# Altium project DashLogger.PrjPcb
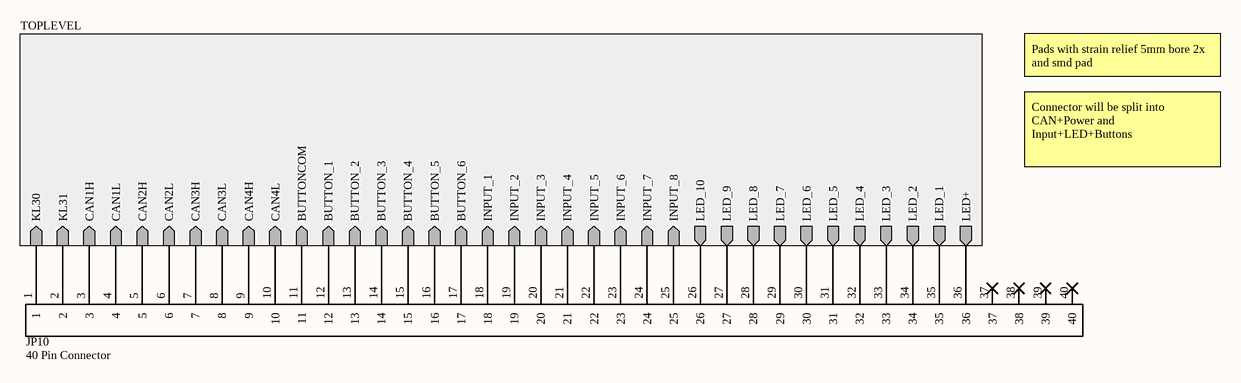
[diagram p0: DashLogger.SchDoc]
9 sheets, 166 parts. Net scope: strictly hierarchical (ports join the sheet entries above them; power ports are local).
Board file: PCB1.PcbDoc
Sheets:
  DashLogger.SchDoc
    TOPLEVEL = TopLevel.SchDoc
      DISPLAY = Display.SchDoc
      MICROCONTROLLER = Microcontroller.SchDoc
      INPUTS = Inputs.SchDoc
      LEDS = LEDs.SchDoc
      POWER = Power.SchDoc
      CAN1 = CANInterface.SchDoc
      CAN2 = CANInterface.SchDoc
      CAN3 = CANInterface.SchDoc
      CAN4 = CANInterface.SchDoc
      STORAGE = Storage.SchDoc

## Sheet DashLogger.SchDoc
size A4; SheetNumber: 1; SheetTotal: 9

### Parts
JP10  40 Pin Connector

### Sub-sheets
TOPLEVEL = TopLevel.SchDoc: KL30 (in), KL31 (in), CAN1H (in), CAN1L (in), CAN2H (in), CAN2L (in), CAN3H (in), CAN3L (in), CAN4H (in), CAN4L (in), BUTTONCOM (in), BUTTON_1 (in), BUTTON_2 (in), BUTTON_3 (in), BUTTON_4 (in), BUTTON_5 (in), BUTTON_6 (in), INPUT_1 (in), INPUT_2 (in), INPUT_3 (in), INPUT_4 (in), INPUT_5 (in), INPUT_6 (in), INPUT_7 (in), INPUT_8 (in), LED_10 (out), LED_9 (out), LED_8 (out), LED_7 (out), LED_6 (out), LED_5 (out), LED_4 (out), LED_3 (out), LED_2 (out), LED_1 (out), LED+ (out)

### Nets
GND: JP10.2 ; sheet TOPLEVEL/KL31
VBAT: JP10.36 ; sheet TOPLEVEL/LED+
Net9R1_2: JP10.3 ; sheet TOPLEVEL/CAN1H
Net9R2_1: JP10.4 ; sheet TOPLEVEL/CAN1L
Net10R1_2: JP10.5 ; sheet TOPLEVEL/CAN2H
Net10R2_1: JP10.6 ; sheet TOPLEVEL/CAN2L
Net11R1_2: JP10.7 ; sheet TOPLEVEL/CAN3H
Net11R2_1: JP10.8 ; sheet TOPLEVEL/CAN3L
Net12R1_2: JP10.9 ; sheet TOPLEVEL/CAN4H
Net12R2_1: JP10.10 ; sheet TOPLEVEL/CAN4L
NetC102_2: JP10.12 ; sheet TOPLEVEL/BUTTON_1
NetC103_2: JP10.13 ; sheet TOPLEVEL/BUTTON_2
NetC104_2: JP10.14 ; sheet TOPLEVEL/BUTTON_3
NetC105_2: JP10.15 ; sheet TOPLEVEL/BUTTON_4
NetC106_2: JP10.16 ; sheet TOPLEVEL/BUTTON_5
NetC107_2: JP10.17 ; sheet TOPLEVEL/BUTTON_6
NetC109_2: JP10.1 ; sheet TOPLEVEL/KL30
NetD4_3: JP10.11 ; sheet TOPLEVEL/BUTTONCOM
NetJP10_18: JP10.18 ; sheet TOPLEVEL/INPUT_1
NetJP10_19: JP10.19 ; sheet TOPLEVEL/INPUT_2
NetJP10_20: JP10.20 ; sheet TOPLEVEL/INPUT_3
NetJP10_21: JP10.21 ; sheet TOPLEVEL/INPUT_4
NetJP10_22: JP10.22 ; sheet TOPLEVEL/INPUT_5
NetJP10_23: JP10.23 ; sheet TOPLEVEL/INPUT_6
NetJP10_24: JP10.24 ; sheet TOPLEVEL/INPUT_7
NetJP10_25: JP10.25 ; sheet TOPLEVEL/INPUT_8
NetJP10_26: JP10.26 ; sheet TOPLEVEL/LED_10
NetJP10_27: JP10.27 ; sheet TOPLEVEL/LED_9
NetJP10_28: JP10.28 ; sheet TOPLEVEL/LED_8
NetJP10_29: JP10.29 ; sheet TOPLEVEL/LED_7
NetJP10_30: JP10.30 ; sheet TOPLEVEL/LED_6
NetJP10_31: JP10.31 ; sheet TOPLEVEL/LED_5
NetJP10_32: JP10.32 ; sheet TOPLEVEL/LED_4
NetJP10_33: JP10.33 ; sheet TOPLEVEL/LED_3
NetJP10_34: JP10.34 ; sheet TOPLEVEL/LED_2
NetJP10_35: JP10.35 ; sheet TOPLEVEL/LED_1

Not connected (* = marked no-connect by the designer): JP10 37* 38* 39* 40*

### Notes on the sheet
- Pads with strain relief 5mm bore 2x and smd pad
- Connector will be split into CAN+Power and Input+LED+Buttons

### Library data of the parts
JP10 = MainConnector

## Sheet TopLevel.SchDoc
size A4; SheetNumber: 2; SheetTotal: 9
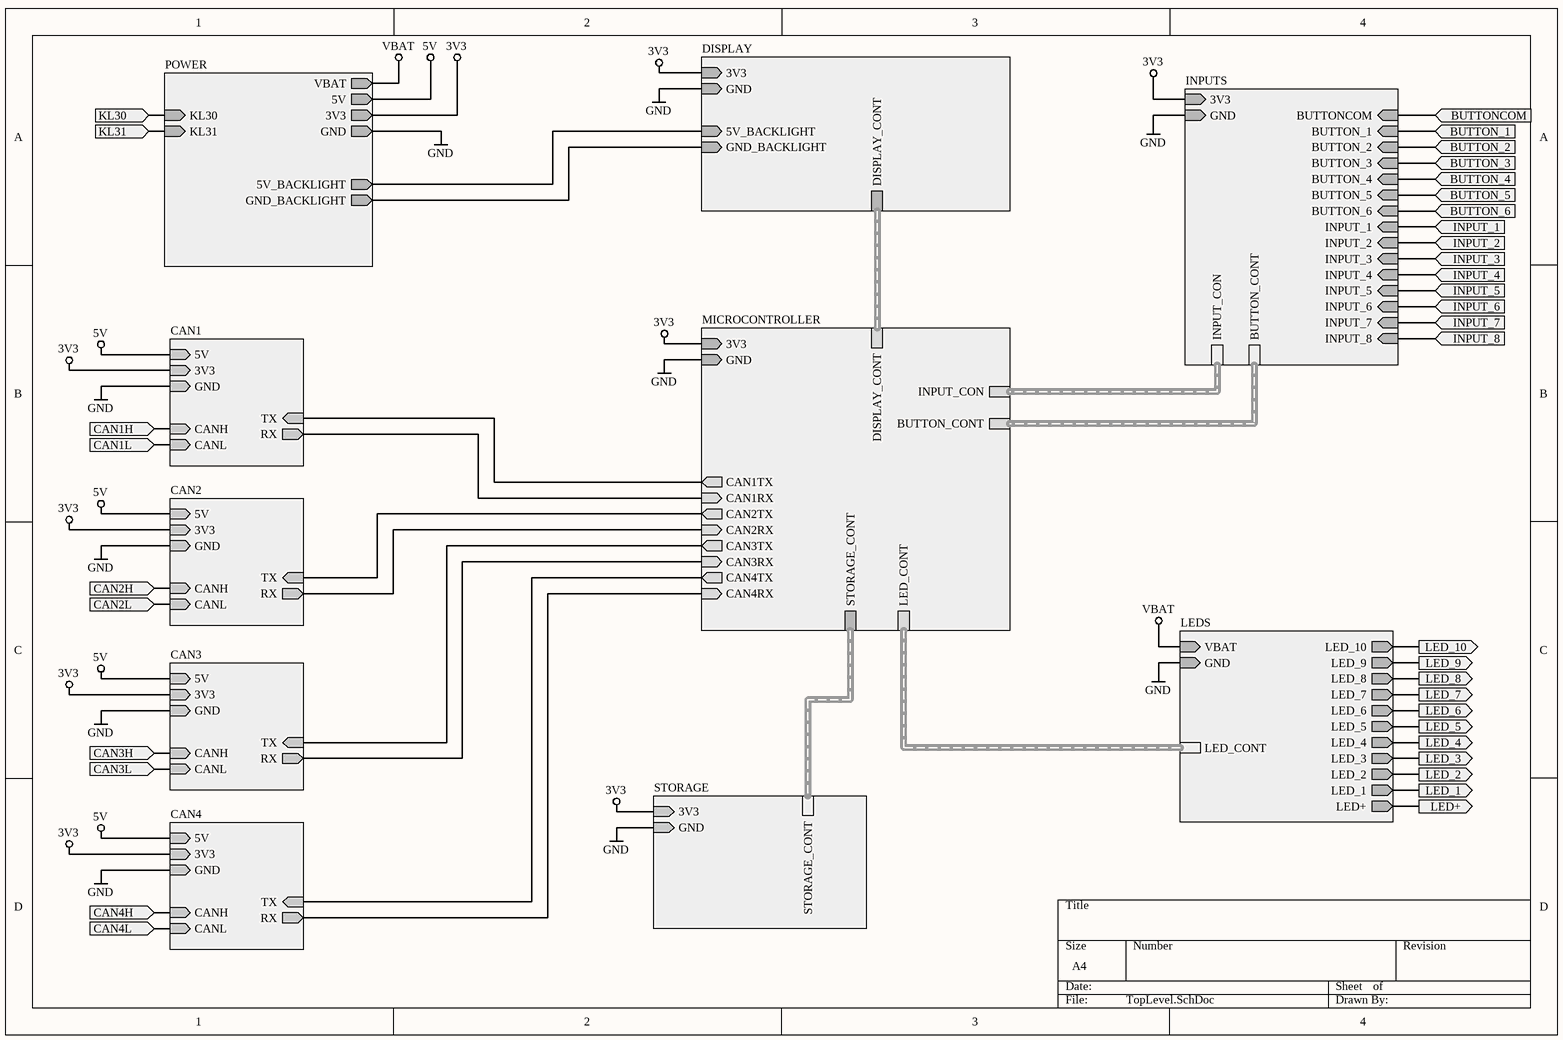
[diagram p1: TopLevel.SchDoc]

### Sub-sheets
CAN1 = CANInterface.SchDoc: 5V (in), GND (in), CANL (in), CANH (in), 3V3 (in), TX (in), RX (out)  | SchematicSymbolName: CAN1
CAN2 = CANInterface.SchDoc: 5V (in), GND (in), CANL (in), CANH (in), 3V3 (in), TX (in), RX (out)  | SchematicSymbolName: CAN2
CAN3 = CANInterface.SchDoc: 5V (in), GND (in), CANL (in), CANH (in), 3V3 (in), TX (in), RX (out)  | SchematicSymbolName: CAN3
CAN4 = CANInterface.SchDoc: 5V (in), GND (in), CANL (in), CANH (in), 3V3 (in), TX (in), RX (out)  | SchematicSymbolName: CAN4
DISPLAY = Display.SchDoc: 5V_BACKLIGHT (in), GND_BACKLIGHT (in), DISPLAY_CONT (harness DISPLAY_CONT), 3V3 (in), GND (in)
INPUTS = Inputs.SchDoc: 3V3 (in), GND (in), BUTTONCOM (in), BUTTON_1 (in), BUTTON_2 (in), BUTTON_3 (in), BUTTON_4 (in), BUTTON_5 (in), BUTTON_6 (in), INPUT_1 (in), INPUT_2 (in), INPUT_3 (in), INPUT_4 (in), INPUT_5 (in), INPUT_6 (in), INPUT_7 (in), INPUT_8 (in), INPUT_CON (harness INPUT_CON), BUTTON_CONT (harness BUTTON_CONT)
LEDS = LEDs.SchDoc: LED_10 (out), LED_9 (out), LED_8 (out), LED_7 (out), LED_6 (out), LED_5 (out), LED_4 (out), LED_3 (out), LED_2 (out), LED_1 (out), LED_CONT (harness LED_CONT), GND (in), VBAT (in), LED+ (out)
MICROCONTROLLER = Microcontroller.SchDoc: STORAGE_CONT (harness STORAGE_CONT), GND (in), 3V3 (in), INPUT_CON (harness INPUT_CON), BUTTON_CONT (harness BUTTON_CONT), LED_CONT (harness LED_CONT), CAN2RX (in), CAN3TX (out), CAN2TX (out), CAN3RX (in), CAN4TX (out), CAN4RX (in), CAN1TX (out), CAN1RX (in), DISPLAY_CONT (harness DISPLAY_CONT)
POWER = Power.SchDoc: KL30 (in), KL31 (in), 5V (out), 5V_BACKLIGHT (out), 3V3 (out), GND (out), GND_BACKLIGHT (out), VBAT (out)
STORAGE = Storage.SchDoc: 3V3 (in), GND (in), STORAGE_CONT (harness STORAGE_CONT)

### Ports
BUTTON_1 (in), BUTTON_2 (in), BUTTON_3 (in), BUTTON_4 (in), BUTTON_5 (in), BUTTON_6 (in), BUTTONCOM (in), CAN1H (in), CAN1L (in), CAN2H (in), CAN2L (in), CAN3H (in), CAN3L (in), CAN4H (in), CAN4L (in), INPUT_1 (in), INPUT_2 (in), INPUT_3 (in), INPUT_4 (in), INPUT_5 (in), INPUT_6 (in), INPUT_7 (in), INPUT_8 (in), KL30 (in), KL31 (in), LED+ (out), LED_1 (out), LED_2 (out), LED_3 (out), LED_4 (out), LED_5 (out), LED_6 (out), LED_7 (out), LED_8 (out), LED_9 (out), LED_10 (out)

### Nets
3V3: sheet DISPLAY/3V3, sheet MICROCONTROLLER/3V3, sheet INPUTS/3V3, sheet POWER/3V3, sheet CAN1/3V3, sheet CAN2/3V3, sheet CAN3/3V3, sheet CAN4/3V3, sheet STORAGE/3V3
5V: sheet POWER/5V, sheet CAN1/5V, sheet CAN2/5V, sheet CAN3/5V, sheet CAN4/5V
GND: port KL31, sheet DISPLAY/GND, sheet MICROCONTROLLER/GND, sheet INPUTS/GND, sheet LEDS/GND, sheet POWER/KL31, sheet POWER/GND, sheet CAN1/GND, sheet CAN2/GND, sheet CAN3/GND, sheet CAN4/GND, sheet STORAGE/GND
VBAT: port LED+, sheet LEDS/VBAT, sheet LEDS/LED+, sheet POWER/VBAT
Net9R1_2: port CAN1H, sheet CAN1/CANH
Net9R2_1: port CAN1L, sheet CAN1/CANL
Net10R1_2: port CAN2H, sheet CAN2/CANH
Net10R2_1: port CAN2L, sheet CAN2/CANL
Net11R1_2: port CAN3H, sheet CAN3/CANH
Net11R2_1: port CAN3L, sheet CAN3/CANL
Net12R1_2: port CAN4H, sheet CAN4/CANH
Net12R2_1: port CAN4L, sheet CAN4/CANL
NetC102_2: port BUTTON_1, sheet INPUTS/BUTTON_1
NetC103_2: port BUTTON_2, sheet INPUTS/BUTTON_2
NetC104_2: port BUTTON_3, sheet INPUTS/BUTTON_3
NetC105_2: port BUTTON_4, sheet INPUTS/BUTTON_4
NetC106_2: port BUTTON_5, sheet INPUTS/BUTTON_5
NetC107_2: port BUTTON_6, sheet INPUTS/BUTTON_6
NetC109_2: port KL30, sheet POWER/KL30
NetD4_3: port BUTTONCOM, sheet INPUTS/BUTTONCOM
NetIC?#1_1: sheet MICROCONTROLLER/CAN1TX, sheet CAN1/TX
NetIC?#1_4: sheet MICROCONTROLLER/CAN1RX, sheet CAN1/RX
NetIC?#2_1: sheet MICROCONTROLLER/CAN2TX, sheet CAN2/TX
NetIC?#2_4: sheet MICROCONTROLLER/CAN2RX, sheet CAN2/RX
NetIC?#3_1: sheet MICROCONTROLLER/CAN3TX, sheet CAN3/TX
NetIC?#3_4: sheet MICROCONTROLLER/CAN3RX, sheet CAN3/RX
NetIC?#4_1: sheet MICROCONTROLLER/CAN4TX, sheet CAN4/TX
NetIC?#4_4: sheet MICROCONTROLLER/CAN4RX, sheet CAN4/RX
NetJP10_18: port INPUT_1, sheet INPUTS/INPUT_1
NetJP10_19: port INPUT_2, sheet INPUTS/INPUT_2
NetJP10_20: port INPUT_3, sheet INPUTS/INPUT_3
NetJP10_21: port INPUT_4, sheet INPUTS/INPUT_4
NetJP10_22: port INPUT_5, sheet INPUTS/INPUT_5
NetJP10_23: port INPUT_6, sheet INPUTS/INPUT_6
NetJP10_24: port INPUT_7, sheet INPUTS/INPUT_7
NetJP10_25: port INPUT_8, sheet INPUTS/INPUT_8
NetJP10_26: port LED_10, sheet LEDS/LED_10
NetJP10_27: port LED_9, sheet LEDS/LED_9
NetJP10_28: port LED_8, sheet LEDS/LED_8
NetJP10_29: port LED_7, sheet LEDS/LED_7
NetJP10_30: port LED_6, sheet LEDS/LED_6
NetJP10_31: port LED_5, sheet LEDS/LED_5
NetJP10_32: port LED_4, sheet LEDS/LED_4
NetJP10_33: port LED_3, sheet LEDS/LED_3
NetJP10_34: port LED_2, sheet LEDS/LED_2
NetJP10_35: port LED_1, sheet LEDS/LED_1
NetJP?#1_17: sheet DISPLAY/5V_BACKLIGHT, sheet POWER/5V_BACKLIGHT
NetJP?#1_19: sheet DISPLAY/GND_BACKLIGHT, sheet POWER/GND_BACKLIGHT

### Buses and harness runs
harness sheet DISPLAY/DISPLAY_CONT = sheet MICROCONTROLLER/DISPLAY_CONT
harness sheet INPUTS/BUTTON_CONT = sheet MICROCONTROLLER/BUTTON_CONT
harness sheet INPUTS/INPUT_CON = sheet MICROCONTROLLER/INPUT_CON
harness sheet LEDS/LED_CONT = sheet MICROCONTROLLER/LED_CONT
harness sheet MICROCONTROLLER/STORAGE_CONT = sheet STORAGE/STORAGE_CONT

## Sheet Display.SchDoc
size A4; SheetNumber: 6; SheetTotal: 9
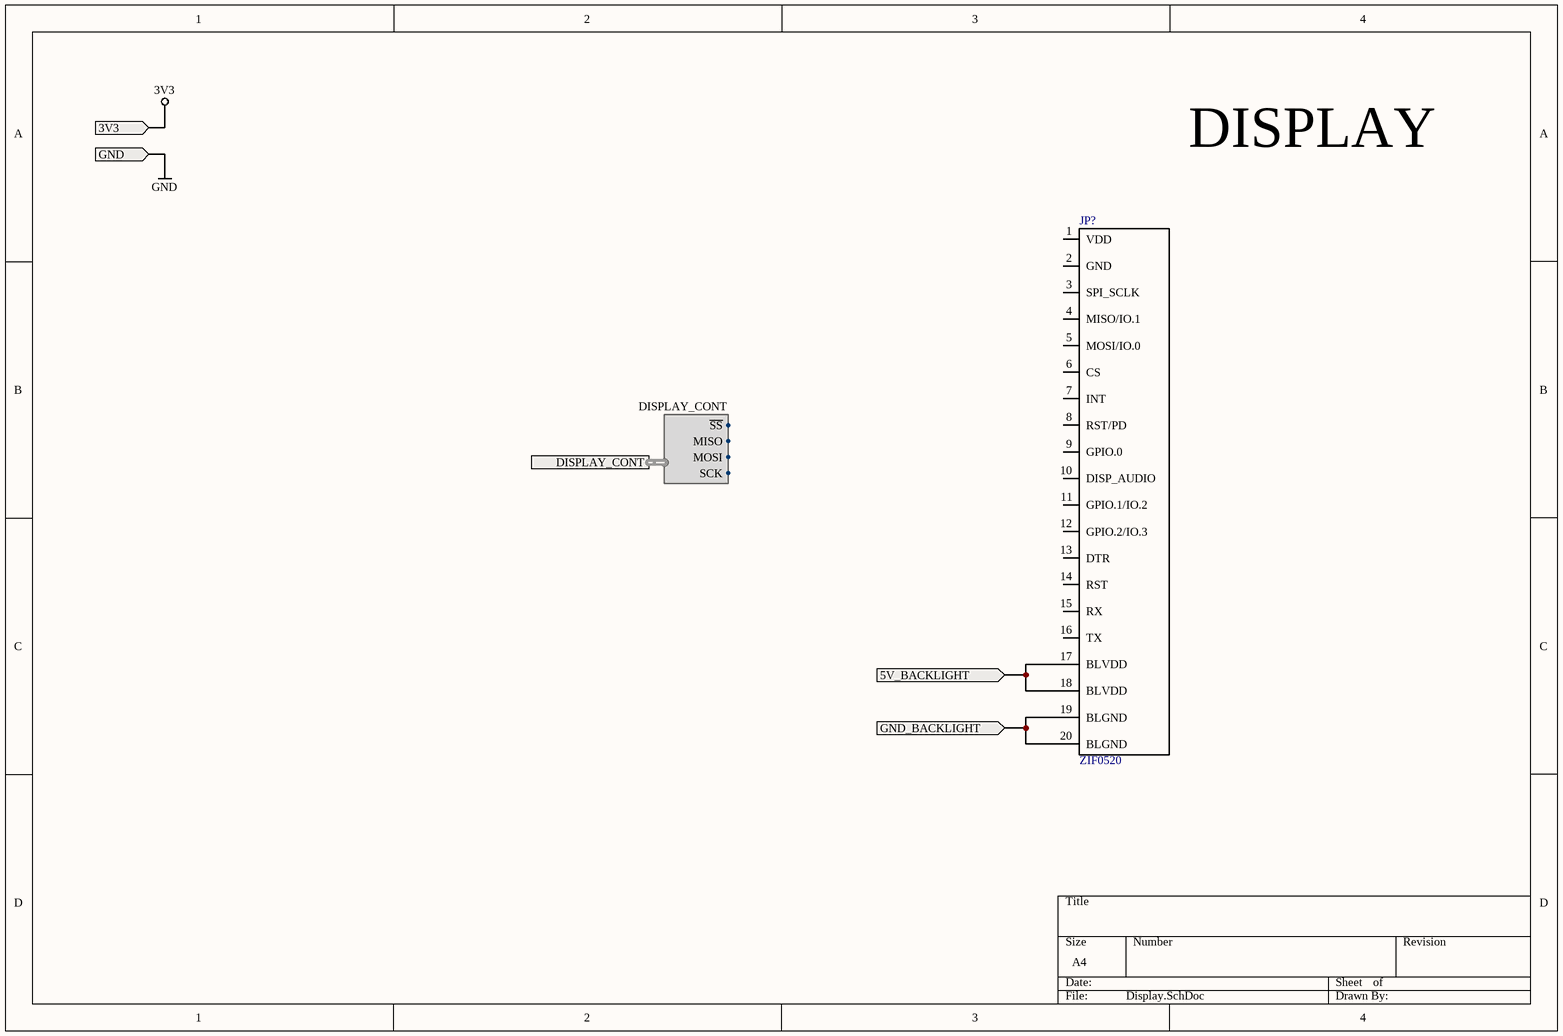
[diagram p2: Display.SchDoc]

### Parts
(Parts that share a designator on the sheet are numbered #1, #2 ... from top to bottom, then left to right.)
JP?#1  ZIF0520

### Ports
3V3 (in), 5V_BACKLIGHT (in), DISPLAY_CONT (harness DISPLAY_CONT), GND (in), GND_BACKLIGHT (in)

### Harnesses
DISPLAY_CONT: MOSI, MISO, SCK, ~{SS}

### Nets
NetJP?#1_17: JP?#1.17(BLVDD) JP?#1.18(BLVDD) ; port 5V_BACKLIGHT
NetJP?#1_19: JP?#1.19(BLGND) JP?#1.20(BLGND) ; port GND_BACKLIGHT

Not connected (* = marked no-connect by the designer): JP?#1 1(VDD) 2(GND) 3(SPI_SCLK) 4(MISO/IO.1) 5(MOSI/IO.0) 6(CS) 7(INT) 8(RST/PD) 9(GPIO.0) 10(DISP_AUDIO) 11(GPIO.1/IO.2) 12(GPIO.2/IO.3) 13(DTR) 14(RST) 15(RX) 16(TX)

### Notes on the sheet
- DISPLAY

### Library data of the parts
JP?#1 = ZIF0520: Display Connector RiBus

## Sheet Microcontroller.SchDoc
size A3; SheetNumber: 5; SheetTotal: 9
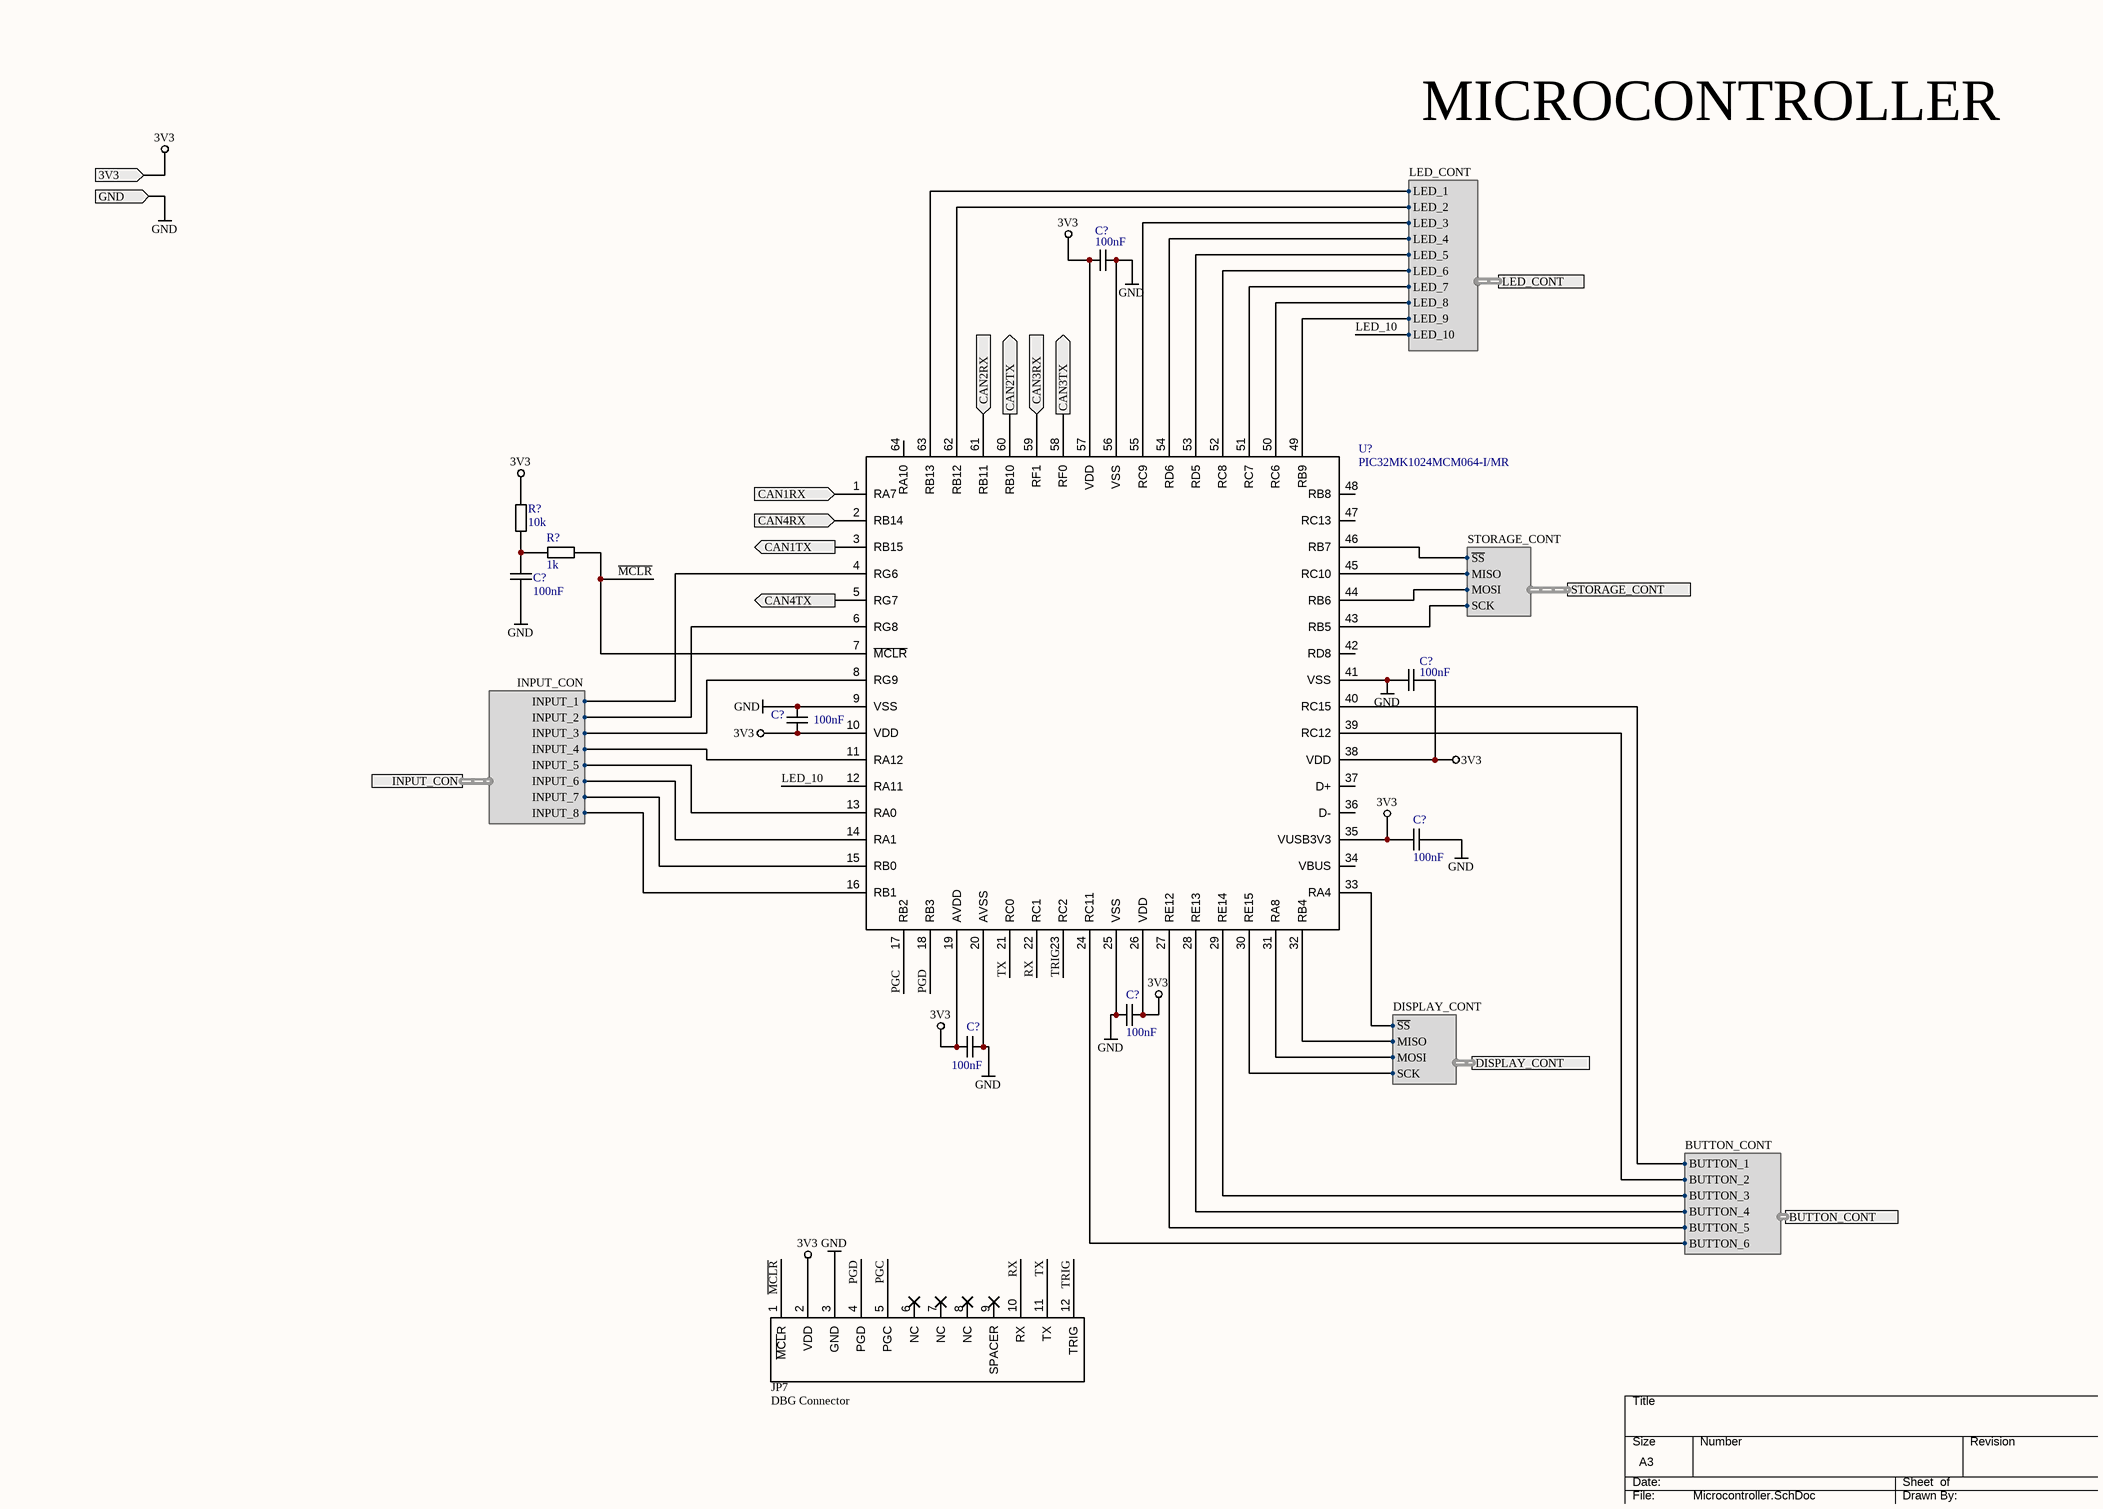
[diagram p3: Microcontroller.SchDoc]

### Parts
(Parts that share a designator on the sheet are numbered #1, #2 ... from top to bottom, then left to right.)
C?#1  100nF  [C_0402]
C?#2  100nF  [C_0402]
C?#3  100nF  [C_0402]
C?#4  100nF  [C_0402]
C?#5  100nF  [C_0402]
C?#6  100nF  [C_0402]
C?#7  100nF  [C_0402]
JP7  DBG Connector  [HDRV12W63P0X254_1X12_3048X254X950P]
R?#1  10k  [R_0402]
R?#2  1k  [R_0402]
U?  PIC32MK1024MCM064-I/MR  [PIC32MK1024MCM064-I/MR]

### Ports
3V3 (in), BUTTON_CONT (harness BUTTON_CONT), CAN1RX (in), CAN1TX (out), CAN2RX (in), CAN2TX (out), CAN3RX (in), CAN3TX (out), CAN4RX (in), CAN4TX (out), DISPLAY_CONT (harness DISPLAY_CONT), GND (in), INPUT_CON (harness INPUT_CON), LED_CONT (harness LED_CONT), STORAGE_CONT (harness STORAGE_CONT)

### Harnesses
INPUT_CON: INPUT_1, INPUT_2, INPUT_3, INPUT_4, INPUT_5, INPUT_6, INPUT_7, INPUT_8
LED_CONT: LED_1, LED_2, LED_3, LED_4, LED_5, LED_6, LED_7, LED_8, LED_9, LED_10
BUTTON_CONT: BUTTON_1, BUTTON_2, BUTTON_3, BUTTON_4, BUTTON_5, BUTTON_6
DISPLAY_CONT: MOSI, MISO, SCK, ~{SS}
STORAGE_CONT: MOSI, MISO, SCK, ~{SS}

### Nets
3V3: C?#1.1 C?#3.1 C?#4.1 C?#5.1 C?#6.1 C?#7.1 JP7.2(VDD) R?#1.2 U?.10(VDD) U?.19(AVDD) U?.26(VDD) U?.35(VUSB3V3) U?.38(VDD) U?.57(VDD) ; port 3V3
GND: C?#1.2 C?#2.1 C?#3.2 C?#4.2 C?#5.2 C?#6.2 C?#7.2 JP7.3(GND) U?.9(VSS) U?.20(AVSS) U?.25(VSS) U?.41(VSS) U?.56(VSS) ; port GND
LED_10: U?.12(RA11) ; port LED_CONT.LED_10
~{MCLR}: JP7.1(~{MCL}R) R?#2.2 U?.7(~{MCLR})  [project net ~{MCLR}_5]
PGC: JP7.5(PGC) U?.17(RB2)  [project net PGC_5]
PGD: JP7.4(PGD) U?.18(RB3)  [project net PGD_5]
RX: JP7.10(RX) U?.22(RC1)  [project net RX_5]
TRIG: JP7.12(TRIG) U?.23(RC2)  [project net TRIG_5]
TX: JP7.11(TX) U?.21(RC0)  [project net TX_5]
NetC102_2: U?.40(RC15) ; port BUTTON_CONT.BUTTON_1
NetC103_2: U?.39(RC12) ; port BUTTON_CONT.BUTTON_2
NetC104_2: U?.29(RE14) ; port BUTTON_CONT.BUTTON_3
NetC105_2: U?.28(RE13) ; port BUTTON_CONT.BUTTON_4
NetC106_2: U?.27(RE12) ; port BUTTON_CONT.BUTTON_5
NetC107_2: U?.24(RC11) ; port BUTTON_CONT.BUTTON_6
NetC?#2_2: C?#2.2 R?#1.1 R?#2.1
NetD5_3: U?.4(RG6) ; port INPUT_CON.INPUT_1
NetD6_3: U?.6(RG8) ; port INPUT_CON.INPUT_2
NetD8_3: U?.8(RG9) ; port INPUT_CON.INPUT_3
NetD10_3: U?.11(RA12) ; port INPUT_CON.INPUT_4
NetD11_3: U?.13(RA0) ; port INPUT_CON.INPUT_5
NetD13_3: U?.14(RA1) ; port INPUT_CON.INPUT_6
NetD15_3: U?.15(RB0) ; port INPUT_CON.INPUT_7
NetD17_3: U?.16(RB1) ; port INPUT_CON.INPUT_8
NetIC?#1_1: U?.3(RB15) ; port CAN1TX
NetIC?#1_4: U?.1(RA7) ; port CAN1RX
NetIC?#2_1: U?.60(RB10) ; port CAN2TX
NetIC?#2_4: U?.61(RB11) ; port CAN2RX
NetIC?#3_1: U?.58(RF0) ; port CAN3TX
NetIC?#3_4: U?.59(RF1) ; port CAN3RX
NetIC?#4_1: U?.5(RG7) ; port CAN4TX
NetIC?#4_4: U?.2(RB14) ; port CAN4RX
NetR25_1: U?.63(RB13) ; port LED_CONT.LED_1
NetR38_1: U?.62(RB12) ; port LED_CONT.LED_2
NetR41_1: U?.55(RC9) ; port LED_CONT.LED_3
NetR44_1: U?.54(RD6) ; port LED_CONT.LED_4
NetR47_1: U?.53(RD5) ; port LED_CONT.LED_5
NetR50_1: U?.52(RC8) ; port LED_CONT.LED_6
NetR53_1: U?.51(RC7) ; port LED_CONT.LED_7
NetR79_1: U?.50(RC6) ; port LED_CONT.LED_8
NetR82_1: U?.49(RB9) ; port LED_CONT.LED_9
NetU?_30: U?.30(RE15) ; port DISPLAY_CONT.SCK
NetU?_31: U?.31(RA8) ; port DISPLAY_CONT.MOSI
NetU?_32: U?.32(RB4) ; port DISPLAY_CONT.MISO
NetU?_33: U?.33(RA4) ; port DISPLAY_CONT.~{SS}
NetU?_43: U?.43(RB5) ; port STORAGE_CONT.SCK
NetU?_44: U?.44(RB6) ; port STORAGE_CONT.MOSI
NetU?_45: U?.45(RC10) ; port STORAGE_CONT.MISO
NetU?_46: U?.46(RB7) ; port STORAGE_CONT.~{SS}

Not connected (* = marked no-connect by the designer): JP7 6(NC)* 7(NC)* 8(NC)* 9(SPACER)*; U? 34(VBUS) 36(D-) 37(D+) 42(RD8) 47(RC13) 48(RB8) 64(RA10)

### Notes on the sheet
- MICROCONTROLLER
- THIS DOCUMENT AND THE DATA DISCLOSED HEREIN OR
- HEREWITH IS THE PROPERTY OF ALTIUM LIMITED AND MAY
- DWG NO:
- REVISION
- REV:
- DESCRIPTION
- DATE
- APPROVED
- BE FREELY DISTRIBUTED IN WHOLE. NO RIGHTS ARE
- RESERVED OR EXPRESS OR IMPLIED WARANTEE GIVEN.
- ENG:
- APPROVALS
- PROJECT
- DSN:
- CHK:
- REFERENCE DOCUMENTS
- PROJECT REVISION:
- TITLE
- DOCUMENT REVISION:
- DESIGN ITEM:
- BOM:
- FAB DWG:
- PCB DWG:
- ASSY DWG:
- SCALE:
- A3
- SIZE
- CAGE CODE
- FILE NAME
- DWG NO.
- SHEET
- OF
- REV

### Library data of the parts
C?#1 C?#3-C?#7 = C0402C104J8RACAUTO: 100nF 10V 0402 X7R
C?#2 = CGA2B3X7R1H104K050BE: 100nF 50V X7R
JP7 = PICKitConnector: 2.54mm Header for Pickit 4
R?#1 = SFR01MZPF1002: 10k 1% 62.5mW
R?#2 = ESR01MZPJ102: 1k 5% 200mW
U? = PIC32MK1024MCM064-I/MR: RC13 and RB8 only Inputs (when used are slower)

## Sheet Inputs.SchDoc
size A4; SheetNumber: 8; SheetTotal: 9
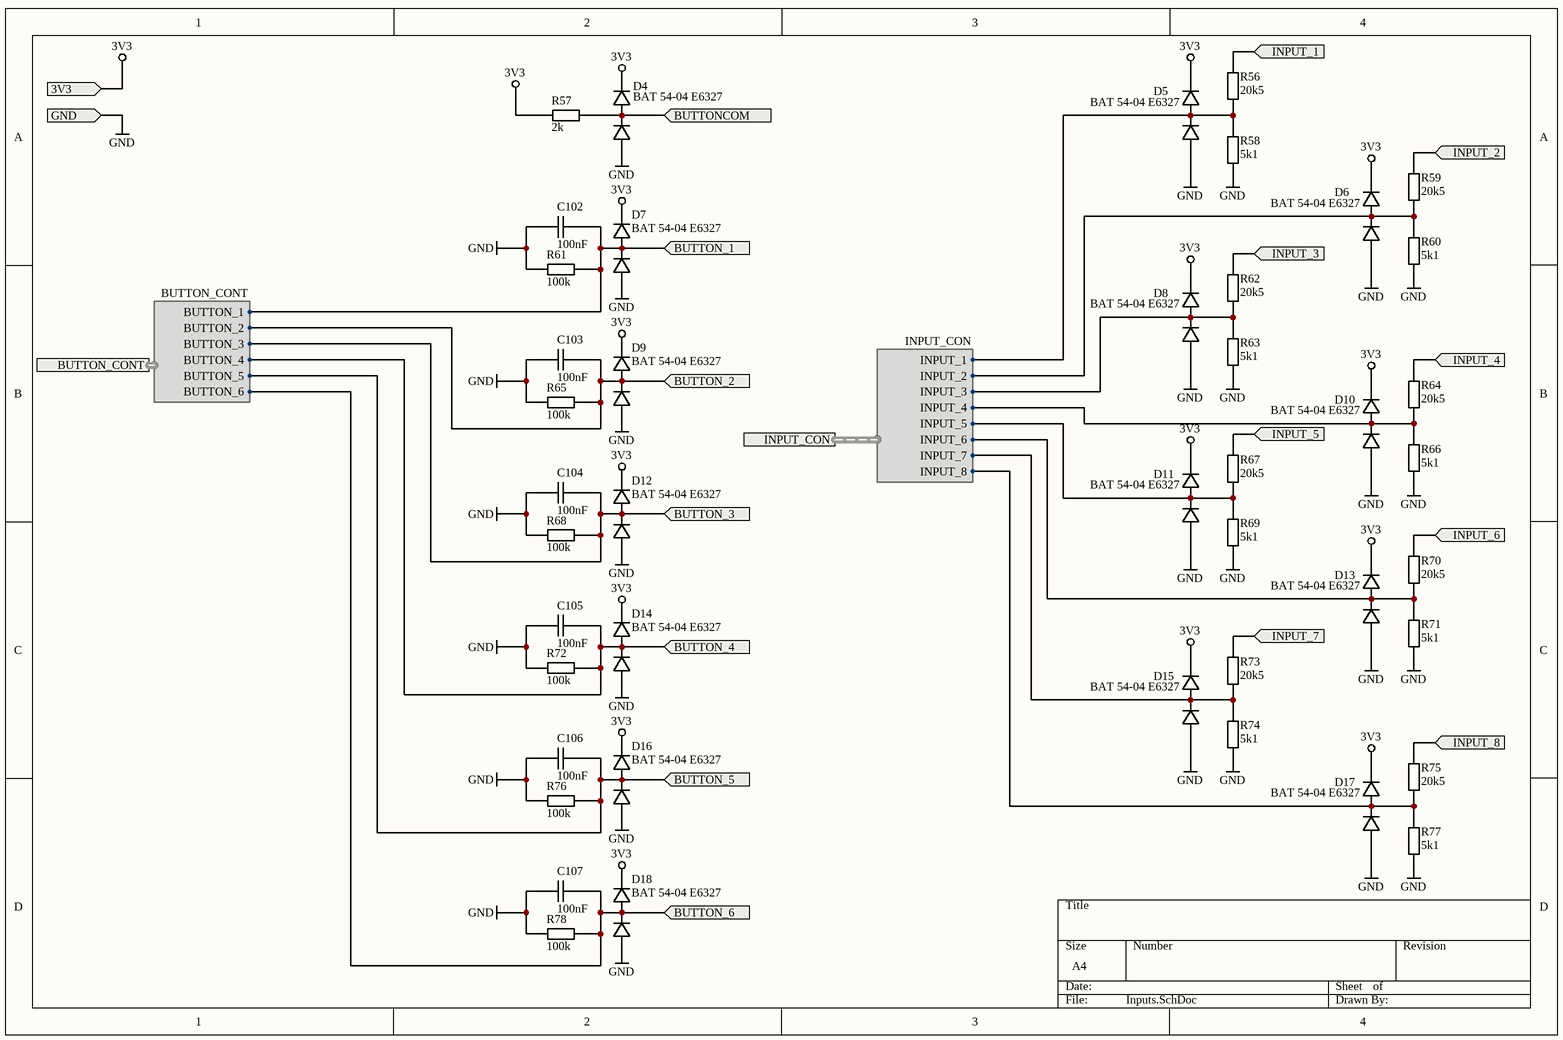
[diagram p4: Inputs.SchDoc]

### Parts
C102  100nF  [C_0402]
C103  100nF  [C_0402]
C104  100nF  [C_0402]
C105  100nF  [C_0402]
C106  100nF  [C_0402]
C107  100nF  [C_0402]
D4  BAT 54-04 E6327  [SOT95P240X110-3N]
D5  BAT 54-04 E6327  [SOT95P240X110-3N]
D6  BAT 54-04 E6327  [SOT95P240X110-3N]
D7  BAT 54-04 E6327  [SOT95P240X110-3N]
D8  BAT 54-04 E6327  [SOT95P240X110-3N]
D9  BAT 54-04 E6327  [SOT95P240X110-3N]
D10  BAT 54-04 E6327  [SOT95P240X110-3N]
D11  BAT 54-04 E6327  [SOT95P240X110-3N]
D12  BAT 54-04 E6327  [SOT95P240X110-3N]
D13  BAT 54-04 E6327  [SOT95P240X110-3N]
D14  BAT 54-04 E6327  [SOT95P240X110-3N]
D15  BAT 54-04 E6327  [SOT95P240X110-3N]
D16  BAT 54-04 E6327  [SOT95P240X110-3N]
D17  BAT 54-04 E6327  [SOT95P240X110-3N]
D18  BAT 54-04 E6327  [SOT95P240X110-3N]
R56  20k5  [R_0402]
R57  2k  [R_0402]
R58  5k1  [R_0402]
R59  20k5  [R_0402]
R60  5k1  [R_0402]
R61  100k  [R_0402]
R62  20k5  [R_0402]
R63  5k1  [R_0402]
R64  20k5  [R_0402]
R65  100k  [R_0402]
R66  5k1  [R_0402]
R67  20k5  [R_0402]
R68  100k  [R_0402]
R69  5k1  [R_0402]
R70  20k5  [R_0402]
R71  5k1  [R_0402]
R72  100k  [R_0402]
R73  20k5  [R_0402]
R74  5k1  [R_0402]
R75  20k5  [R_0402]
R76  100k  [R_0402]
R77  5k1  [R_0402]
R78  100k  [R_0402]

### Ports
3V3 (in), BUTTON_1 (in), BUTTON_2 (in), BUTTON_3 (in), BUTTON_4 (in), BUTTON_5 (in), BUTTON_6 (in), BUTTON_CONT (harness BUTTON_CONT), BUTTONCOM (in), GND (in), INPUT_1 (in), INPUT_2 (in), INPUT_3 (in), INPUT_4 (in), INPUT_5 (in), INPUT_6 (in), INPUT_7 (in), INPUT_8 (in), INPUT_CON (harness INPUT_CON)

### Harnesses
BUTTON_CONT: BUTTON_1, BUTTON_2, BUTTON_3, BUTTON_4, BUTTON_5, BUTTON_6
INPUT_CON: INPUT_1, INPUT_2, INPUT_3, INPUT_4, INPUT_5, INPUT_6, INPUT_7, INPUT_8

### Nets
3V3: D4.2 D5.2 D6.2 D7.2 D8.2 D9.2 D10.2 D11.2 D12.2 D13.2 D14.2 D15.2 D16.2 D17.2 D18.2 R57.1 ; port 3V3
GND: C102.1 C103.1 C104.1 C105.1 C106.1 C107.1 D4.1 D5.1 D6.1 D7.1 D8.1 D9.1 D10.1 D11.1 D12.1 D13.1 D14.1 D15.1 D16.1 D17.1 D18.1 R58.1 R60.1 R61.1 R63.1 R65.1 R66.1 R68.1 R69.1 R71.1 R72.1 R74.1 R76.1 R77.1 R78.1 ; port GND
NetC102_2: C102.2 D7.3 R61.2 ; port BUTTON_1, port BUTTON_CONT.BUTTON_1
NetC103_2: C103.2 D9.3 R65.2 ; port BUTTON_2, port BUTTON_CONT.BUTTON_2
NetC104_2: C104.2 D12.3 R68.2 ; port BUTTON_3, port BUTTON_CONT.BUTTON_3
NetC105_2: C105.2 D14.3 R72.2 ; port BUTTON_4, port BUTTON_CONT.BUTTON_4
NetC106_2: C106.2 D16.3 R76.2 ; port BUTTON_5, port BUTTON_CONT.BUTTON_5
NetC107_2: C107.2 D18.3 R78.2 ; port BUTTON_6, port BUTTON_CONT.BUTTON_6
NetD4_3: D4.3 R57.2 ; port BUTTONCOM
NetD5_3: D5.3 R56.1 R58.2 ; port INPUT_CON.INPUT_1
NetD6_3: D6.3 R59.1 R60.2 ; port INPUT_CON.INPUT_2
NetD8_3: D8.3 R62.1 R63.2 ; port INPUT_CON.INPUT_3
NetD10_3: D10.3 R64.1 R66.2 ; port INPUT_CON.INPUT_4
NetD11_3: D11.3 R67.1 R69.2 ; port INPUT_CON.INPUT_5
NetD13_3: D13.3 R70.1 R71.2 ; port INPUT_CON.INPUT_6
NetD15_3: D15.3 R73.1 R74.2 ; port INPUT_CON.INPUT_7
NetD17_3: D17.3 R75.1 R77.2 ; port INPUT_CON.INPUT_8
NetJP10_18: R56.2 ; port INPUT_1
NetJP10_19: R59.2 ; port INPUT_2
NetJP10_20: R62.2 ; port INPUT_3
NetJP10_21: R64.2 ; port INPUT_4
NetJP10_22: R67.2 ; port INPUT_5
NetJP10_23: R70.2 ; port INPUT_6
NetJP10_24: R73.2 ; port INPUT_7
NetJP10_25: R75.2 ; port INPUT_8

### Library data of the parts
C102-C107 = C0402C104J8RACAUTO: 100nF 10V 0402 X7R
D4-D18 = BAT 54-04 E6327: Clamping Diode
R56 R59 R62 R64 R67 R70 R73 R75 = ERJ2RKF2052X: 20k5 1% 100mW
R57 = AC0402FR-072KL: 2k 1% 62.5mW
R58 R60 R63 R66 R69 R71 R74 R77 = MP000528: 5k1 1% 100mW
R61 R65 R68 R72 R76 R78 = CRCW0402100KJNED: 100k 5% 62.5mW

## Sheet LEDs.SchDoc
size A4; SheetNumber: 8; SheetTotal: 9
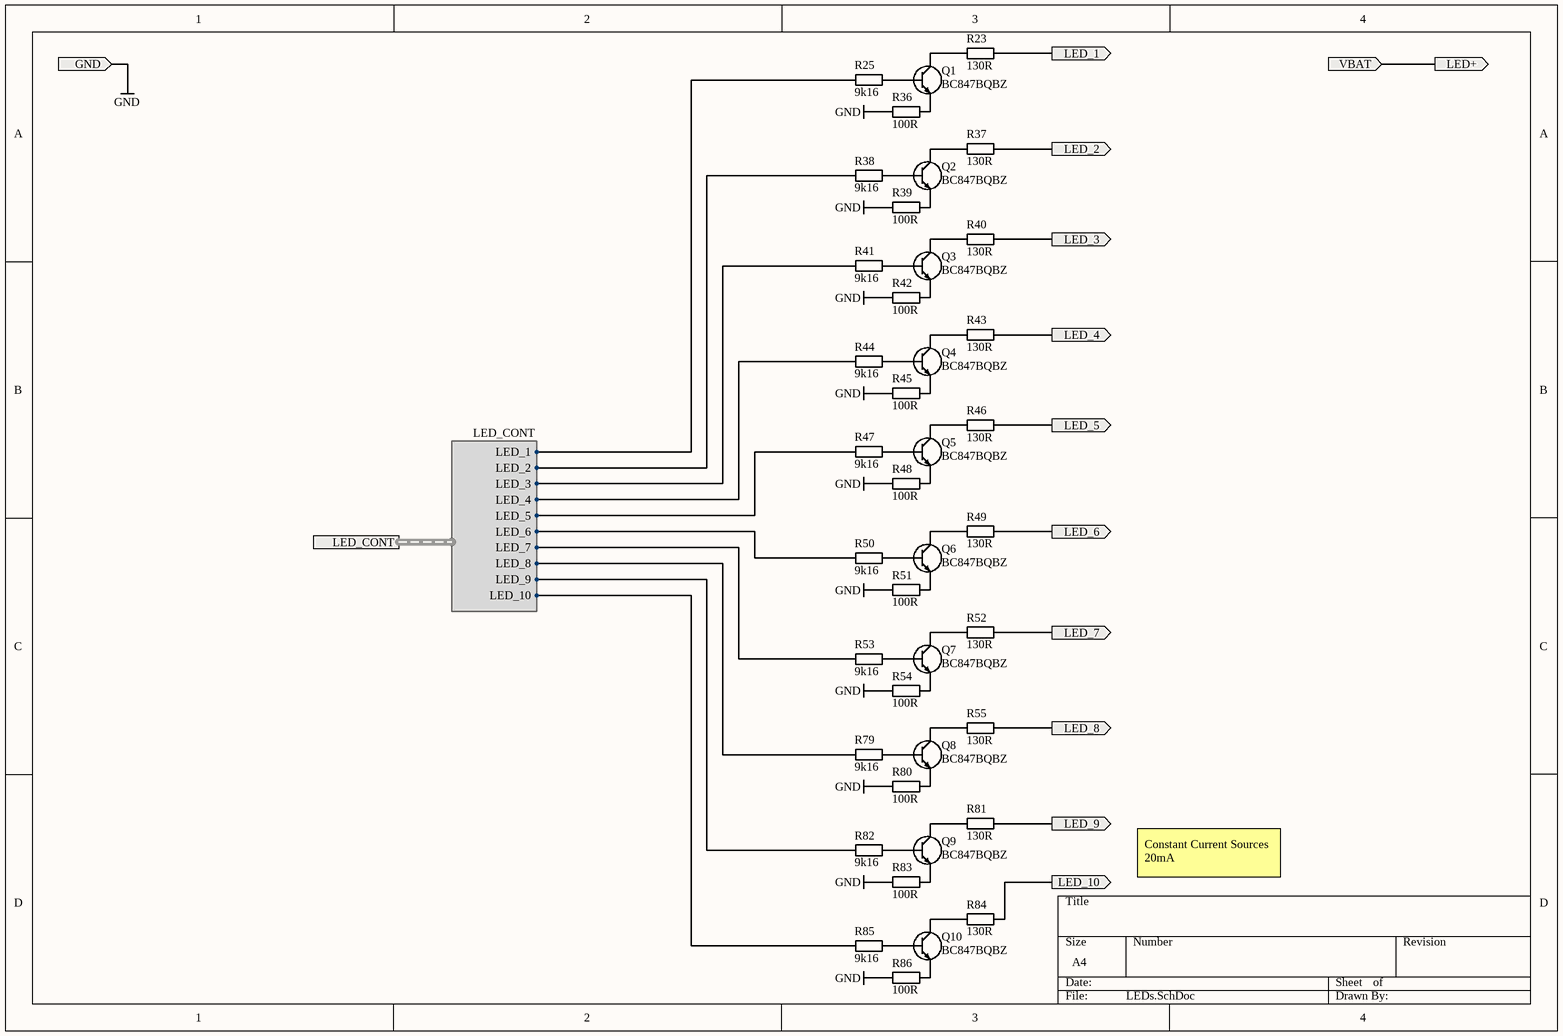
[diagram p5: LEDs.SchDoc]

### Parts
Q1  BC847BQBZ  [PESD2CANFD24UQBZ]
Q2  BC847BQBZ  [PESD2CANFD24UQBZ]
Q3  BC847BQBZ  [PESD2CANFD24UQBZ]
Q4  BC847BQBZ  [PESD2CANFD24UQBZ]
Q5  BC847BQBZ  [PESD2CANFD24UQBZ]
Q6  BC847BQBZ  [PESD2CANFD24UQBZ]
Q7  BC847BQBZ  [PESD2CANFD24UQBZ]
Q8  BC847BQBZ  [PESD2CANFD24UQBZ]
Q9  BC847BQBZ  [PESD2CANFD24UQBZ]
Q10  BC847BQBZ  [PESD2CANFD24UQBZ]
R23  130R  [R_1210]
R25  9k16  [R_0402]
R36  100R  [R_1210]
R37  130R  [R_1210]
R38  9k16  [R_0402]
R39  100R  [R_1210]
R40  130R  [R_1210]
R41  9k16  [R_0402]
R42  100R  [R_1210]
R43  130R  [R_1210]
R44  9k16  [R_0402]
R45  100R  [R_1210]
R46  130R  [R_1210]
R47  9k16  [R_0402]
R48  100R  [R_1210]
R49  130R  [R_1210]
R50  9k16  [R_0402]
R51  100R  [R_1210]
R52  130R  [R_1210]
R53  9k16  [R_0402]
R54  100R  [R_1210]
R55  130R  [R_1210]
R79  9k16  [R_0402]
R80  100R  [R_1210]
R81  130R  [R_1210]
R82  9k16  [R_0402]
R83  100R  [R_1210]
R84  130R  [R_1210]
R85  9k16  [R_0402]
R86  100R  [R_1210]

### Ports
GND (in), LED+ (out), LED_1 (out), LED_2 (out), LED_3 (out), LED_4 (out), LED_5 (out), LED_6 (out), LED_7 (out), LED_8 (out), LED_9 (out), LED_10 (out), LED_CONT (harness LED_CONT), VBAT (in)

### Harnesses
LED_CONT: LED_1, LED_2, LED_3, LED_4, LED_5, LED_6, LED_7, LED_8, LED_9, LED_10

### Nets
GND: R36.2 R39.2 R42.2 R45.2 R48.2 R51.2 R54.2 R80.2 R83.2 R86.2 ; port GND
VBAT: port VBAT, port LED+
LED_10: R85.1 ; port LED_CONT.LED_10
NetJP10_26: R84.2 ; port LED_10
NetJP10_27: R81.2 ; port LED_9
NetJP10_28: R55.2 ; port LED_8
NetJP10_29: R52.2 ; port LED_7
NetJP10_30: R49.2 ; port LED_6
NetJP10_31: R46.2 ; port LED_5
NetJP10_32: R43.2 ; port LED_4
NetJP10_33: R40.2 ; port LED_3
NetJP10_34: R37.2 ; port LED_2
NetJP10_35: R23.2 ; port LED_1
NetQ1_1: Q1.1(B) R25.2
NetQ1_2: Q1.2(E) R36.1
NetQ1_3: Q1.3(C) R23.1
NetQ2_1: Q2.1(B) R38.2
NetQ2_2: Q2.2(E) R39.1
NetQ2_3: Q2.3(C) R37.1
NetQ3_1: Q3.1(B) R41.2
NetQ3_2: Q3.2(E) R42.1
NetQ3_3: Q3.3(C) R40.1
NetQ4_1: Q4.1(B) R44.2
NetQ4_2: Q4.2(E) R45.1
NetQ4_3: Q4.3(C) R43.1
NetQ5_1: Q5.1(B) R47.2
NetQ5_2: Q5.2(E) R48.1
NetQ5_3: Q5.3(C) R46.1
NetQ6_1: Q6.1(B) R50.2
NetQ6_2: Q6.2(E) R51.1
NetQ6_3: Q6.3(C) R49.1
NetQ7_1: Q7.1(B) R53.2
NetQ7_2: Q7.2(E) R54.1
NetQ7_3: Q7.3(C) R52.1
NetQ8_1: Q8.1(B) R79.2
NetQ8_2: Q8.2(E) R80.1
NetQ8_3: Q8.3(C) R55.1
NetQ9_1: Q9.1(B) R82.2
NetQ9_2: Q9.2(E) R83.1
NetQ9_3: Q9.3(C) R81.1
NetQ10_1: Q10.1(B) R85.2
NetQ10_2: Q10.2(E) R86.1
NetQ10_3: Q10.3(C) R84.1
NetR25_1: R25.1 ; port LED_CONT.LED_1
NetR38_1: R38.1 ; port LED_CONT.LED_2
NetR41_1: R41.1 ; port LED_CONT.LED_3
NetR44_1: R44.1 ; port LED_CONT.LED_4
NetR47_1: R47.1 ; port LED_CONT.LED_5
NetR50_1: R50.1 ; port LED_CONT.LED_6
NetR53_1: R53.1 ; port LED_CONT.LED_7
NetR79_1: R79.1 ; port LED_CONT.LED_8
NetR82_1: R82.1 ; port LED_CONT.LED_9

### Notes on the sheet
- Constant Current Sources 20mA

### Library data of the parts
Q1-Q10 = BC847BQBZ: NPN Transistor 45V 100mA 100MHz; Manufacturer_Name: Nexperia; Manufacturer_Part_Number: BC847CQBZ; Datasheet Link: https://assets.nexperia.com/documents/data-sheet/BC847XQB_SER.pdf; Height: 0.5mm; Mouser Part Number: 771-BC847CQBZ; Mouser Price/Stock: https://www.mouser.co.uk/ProductDetail/Nexperia/BC847CQBZ?qs=GBLSl2AkirulMH7yF0zTsA%3D%3D
R23 R37 R40 R43 R46 R49 R52 R55 R81 R84 = ERJP14F1300U: 130R 1% 500mW
R25 R38 R41 R44 R47 R50 R53 R79 R82 R85 = MCMR04X6191FTL: 9k16 1% 62.5mW
R36 R39 R42 R45 R48 R51 R54 R80 R83 R86 = ERJP14F1000U: 100R 1% 500mW

## Sheet Power.SchDoc
size A4; Author: Frederic Emmerth; DrawnBy: Frederic Emmerth; Organization: GFR; DocumentNumber: 4; SheetNumber: 4; SheetTotal: 9
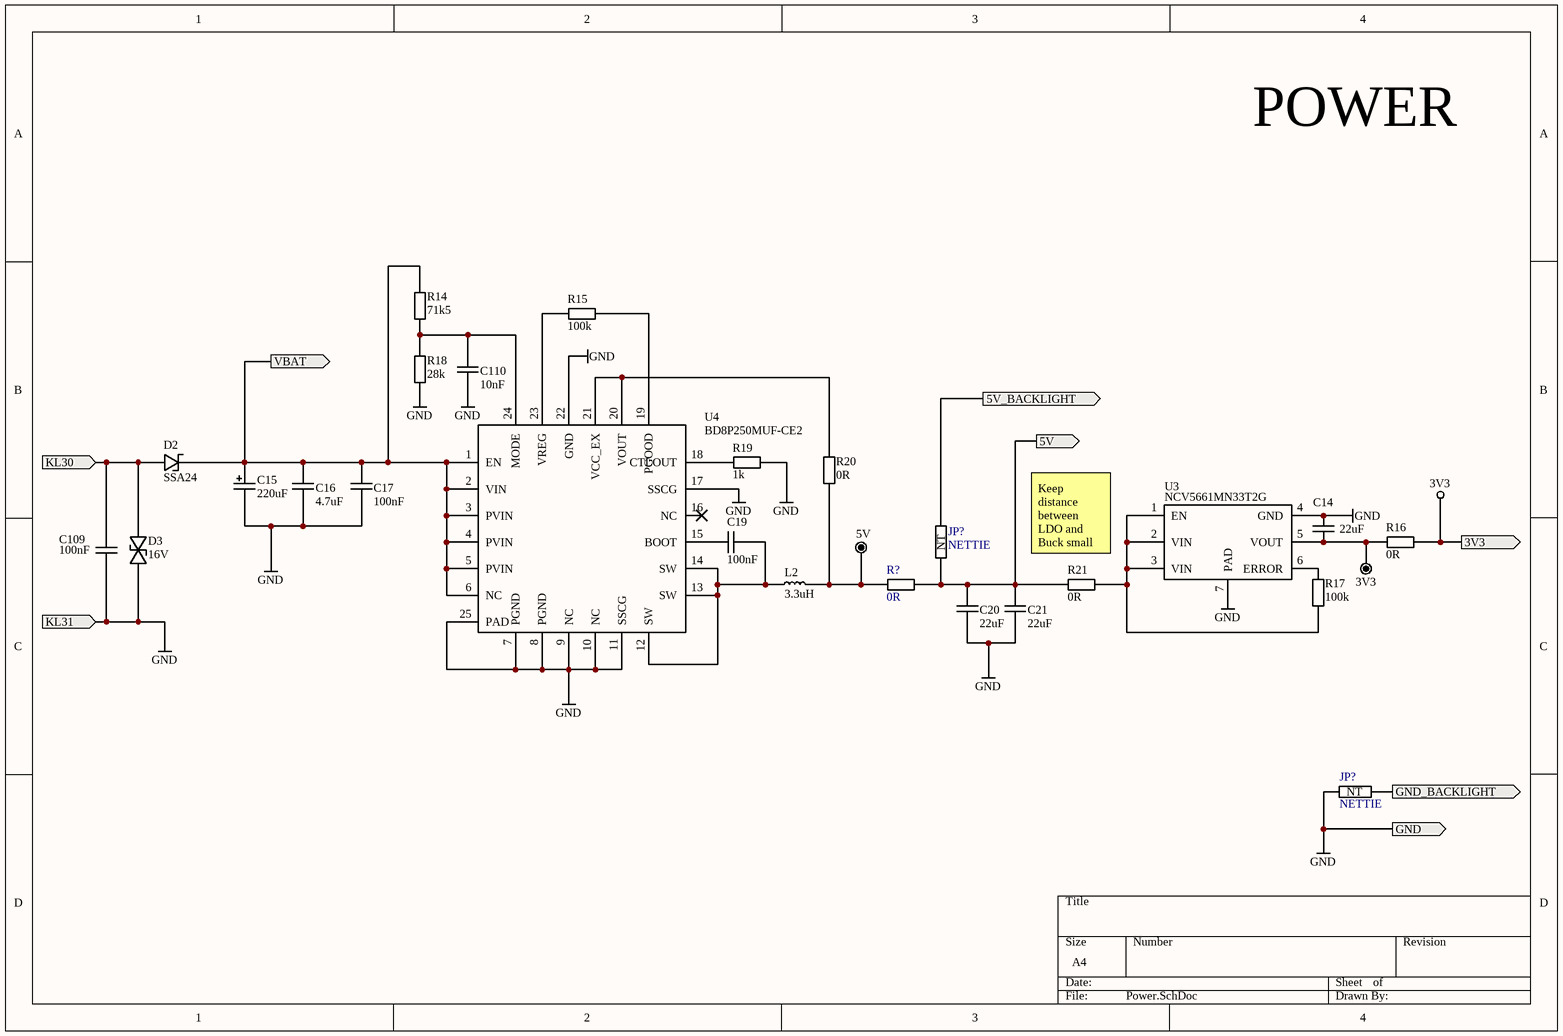
[diagram p6: Power.SchDoc]

### Parts
(Parts that share a designator on the sheet are numbered #1, #2 ... from top to bottom, then left to right.)
C14  22uF  [C_1210]
C15  220uF  [MAL225099909E3]
C16  4.7uF  [C_1210]
C17  100nF  [C_0402]
C19  100nF  [C_0402]
C20  22uF  [C_1210]
C21  22uF  [C_1210]
C109  100nF  [C_0402]
C110  10nF  [C_0402]
D2  SSA24  [SSA24]
D3  16V  [SM30T19CAY]
JP2  TestpointName: 3V3  [Manual Testpoint]  (hidden comment: Testpoint)
JP3  TestpointName: 5V  [Manual Testpoint]  (hidden comment: Testpoint)
JP?#2  NETTIE  [NETTIE]
JP?#3  NETTIE  [NETTIE]
L2  3.3uH  [CLF6045NIT-3R3N-D]
R14  71k5  [R_0402]
R15  100k  [R_0402]
R16  0R  [R_1210]
R17  100k  [R_0402]
R18  28k  [R_0402]
R19  1k  [R_0402]
R20  0R  [R_1210]
R21  0R  [R_1210]
R?#3  0R  [R_1210]
U3  NCV5661MN33T2G  [NCV5661MN33T2G]
U4  BD8P250MUF-CE2  [BD8P250MUF-CE2]

### Ports
3V3 (out), 5V (out), 5V_BACKLIGHT (out), GND (out), GND_BACKLIGHT (out), KL30 (in), KL31 (in), VBAT (out)

### Nets
3V3: R16.2 ; port 3V3
5V: C20.2 C21.2 JP?#2.1 R21.2 R?#3.2 ; port 5V
GND: C14.2 C15.2 C16.1 C17.1 C20.1 C21.1 C109.1 C110.1 D3.1 JP?#3.1 R18.1 R19.2 U3.4(GND) U3.7(PAD) U4.7(PGND) U4.8(PGND) U4.9(NC) U4.10(NC) U4.11(SSCG) U4.17(SSCG) U4.22(GND) U4.25(PAD) ; port KL31, port GND
VBAT: C15.1 C16.2 C17.2 D2.1 R14.2 U4.1(EN) U4.2(VIN) U4.3(PVIN) U4.4(PVIN) U4.5(PVIN) U4.6(NC) ; port VBAT
NetC14_1: C14.1 JP2.1 R16.1 U3.5(VOUT)
NetC19_1: C19.1 U4.15(BOOT)
NetC19_2: C19.2 L2.1 U4.12(SW) U4.13(SW) U4.14(SW)
NetC109_2: C109.2 D2.2 D3.2 ; port KL30
NetC110_2: C110.2 R14.1 R18.2 U4.24(MODE)
NetJP3_1: JP3.1 L2.2 R20.1 R?#3.1
NetJP?#1_17: JP?#2.2 ; port 5V_BACKLIGHT
NetJP?#1_19: JP?#3.2 ; port GND_BACKLIGHT
NetR15_1: R15.1 U4.23(VREG)
NetR15_2: R15.2 U4.19(PGOOD)
NetR17_1: R17.1 R21.1 U3.1(EN) U3.2(VIN) U3.3(VIN)
NetR17_2: R17.2 U3.6(ERROR)
NetR19_1: R19.1 U4.18(CTLOUT)
NetR20_2: R20.2 U4.20(VOUT) U4.21(VCC_EX)

Not connected (* = marked no-connect by the designer): U4 16(NC)*

### Notes on the sheet
- POWER
- (near R21) Keep distance between LDO and Buck small
- (in symbol NETTIE) NT

### Library data of the parts
C14 C20 C21 = GCM32ER71A226KE12L: 22uF 10V X7R
C15 = MAL225099909E3: 220uF 100V
C16 = GCJ32ER71H475KA12L: 4.7uF 50V X7R
C17 C19 C109 = CGA2B3X7R1H104K050BE: 100nF 50V X7R
C110 = GCM155R71H103KA55D: 10nF 50V 0402 X7R
D2 = SSA24: 40V 2A 500mV
D3 = SM30T19CAY: 16V 31.5V
JP2 JP3 = Manual Testpoint
JP?#2 JP?#3 = NETTIE: 4-Way Net Tie
L2 = CLF6045NIT-3R3N-D: 3.3uH 19mohms 3.5A
R14 = MCMR04X7152FTL: 71k5 1% 62.5mW
R15 R17 = CRCW0402100KJNED: 100k 5% 62.5mW
R16 R20 R21 R?#3 = RK73Z2ETTD.: 0R 10A
R18 = MCMR04X2802FTL: 28k 1% 62.5mW
R19 = ESR01MZPJ102: 1k 5% 200mW
U3 = NCV5661MN33T2G: 3V3 LDO
U4 = BD8P250MUF-CE2: Buck Regulator

## Sheet CANInterface.SchDoc
size A4; SheetNumber: 3; SheetTotal: 9
Used 4 times, as channels TOPLEVEL/CAN1, TOPLEVEL/CAN2, TOPLEVEL/CAN3, TOPLEVEL/CAN4. Parts and nets are listed once, with the designators drawn on the sheet.
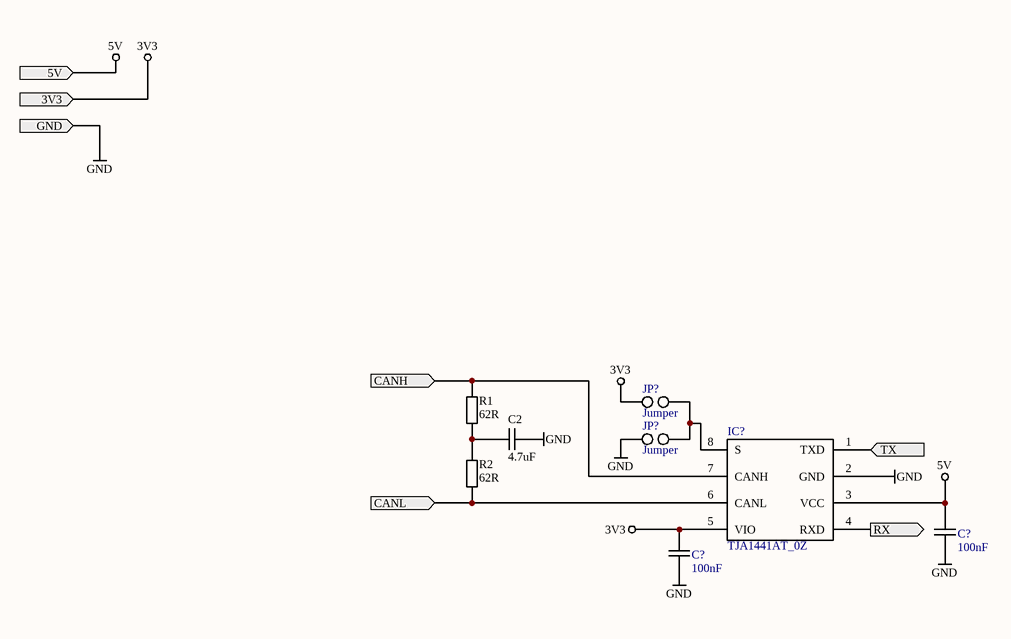
[diagram p7: CANInterface.SchDoc]

### Parts
(Parts that share a designator on the sheet are numbered #1, #2 ... from top to bottom, then left to right.)
C2  4.7uF  [C_1210]
C?#1  100nF  [C_0402]
C?#2  100nF  [C_0402]
IC?  TJA1441AT_0Z  [SOIC127P600X175-8N]
JP?#1  Jumper  [7731111802LF]
JP?#2  Jumper  [7731111802LF]
R1  62R  [R_1210]
R2  62R  [R_1210]

### Ports
3V3 (in), 5V (in), CANH (in), CANL (in), GND (in), RX (out), TX (in)

### Nets
3V3: C?#2.2 IC?.5(VIO) JP?#1.1 ; port 3V3
5V: C?#1.2 IC?.3(VCC) ; port 5V
GND: C2.2 C?#1.1 C?#2.1 IC?.2(GND) JP?#2.2 ; port GND
CANH: IC?.7(CANH) R1.2 ; port CANH
CANL: IC?.6(CANL) R2.1 ; port CANL
RX: IC?.4(RXD) ; port RX
TX: IC?.1(TXD) ; port TX
NetC2_1: C2.1 R1.1 R2.2
NetIC?_8: IC?.8(S) JP?#1.2 JP?#2.1

### Channels
TOPLEVEL/CAN1: designators C2=9C2 C?=C?#9 C?=C?#8 IC?=IC?#1 JP?=JP?#5 JP?=JP?#4 R1=9R1 R2=9R2; ports 3V3=3V3 5V=5V CANH=Net9R1_2 CANL=Net9R2_1 GND=GND RX=NetIC?#1_4 TX=NetIC?#1_1
TOPLEVEL/CAN2: designators C2=10C2 C?=C?#11 C?=C?#10 IC?=IC?#2 JP?=JP?#7 JP?=JP?#6 R1=10R1 R2=10R2; ports 3V3=3V3 5V=5V CANH=Net10R1_2 CANL=Net10R2_1 GND=GND RX=NetIC?#2_4 TX=NetIC?#2_1
TOPLEVEL/CAN3: designators C2=11C2 C?=C?#13 C?=C?#12 IC?=IC?#3 JP?=JP?#9 JP?=JP?#8 R1=11R1 R2=11R2; ports 3V3=3V3 5V=5V CANH=Net11R1_2 CANL=Net11R2_1 GND=GND RX=NetIC?#3_4 TX=NetIC?#3_1
TOPLEVEL/CAN4: designators C2=12C2 C?=C?#15 C?=C?#14 IC?=IC?#4 JP?=JP?#11 JP?=JP?#10 R1=12R1 R2=12R2; ports 3V3=3V3 5V=5V CANH=Net12R1_2 CANL=Net12R2_1 GND=GND RX=NetIC?#4_4 TX=NetIC?#4_1

### Library data of the parts
C2 = GCJ32ER71H475KA12L: 4.7uF 50V X7R
C?#1 C?#2 = CGA2B3X7R1H104K050BE: 100nF 50V X7R
IC? = TJA1441AT_0Z: CAN Transciever; Manufacturer_Name: NXP; Manufacturer_Part_Number: TJA1441AT/0Z; Datasheet Link: https://www.mouser.it/datasheet/2/302/TJA1441-1949304.pdf; Height: 1.75mm; Mouser Part Number: 771-TJA1441AT/0Z; Mouser Price/Stock: https://www.mouser.co.uk/ProductDetail/NXP-Semiconductors/TJA1441AT-0Z?qs=eP2BKZSCXI7fcqmlBnmIFw%3D%3D; Arrow Part Number: TJA1441AT/0Z; Arrow Price/Stock: https://www.arrow.com/en/products/tja1441at0z/nxp-semiconductors?region=nac
JP?#1 JP?#2 = Jumper 2.45mm: 2.45mm Jumper; Manufacturer_Name: Amphenol; Manufacturer_Part_Number: 77311-118-02LF; Datasheet Link: https://cdn.amphenol-icc.com/media/wysiwyg/files/drawing/77311.pdf; Height: 8.94mm; Mouser Part Number: 649-77311-118-02LF; Mouser Price/Stock: https://www.mouser.co.uk/ProductDetail/Amphenol-FCI/77311-118-02LF?qs=5xI8GKdkXlmD4cdGgiyi7w%3D%3D; Arrow Part Number: 77311-118-02LF; Arrow Price/Stock: https://www.arrow.com/en/products/77311-118-02lf/amphenol-fci?region=europe
R1 R2 = ERJU14F62R0U: 62R 1% 500mW

## Sheet Storage.SchDoc
size A3; SheetNumber: 7; SheetTotal: 9
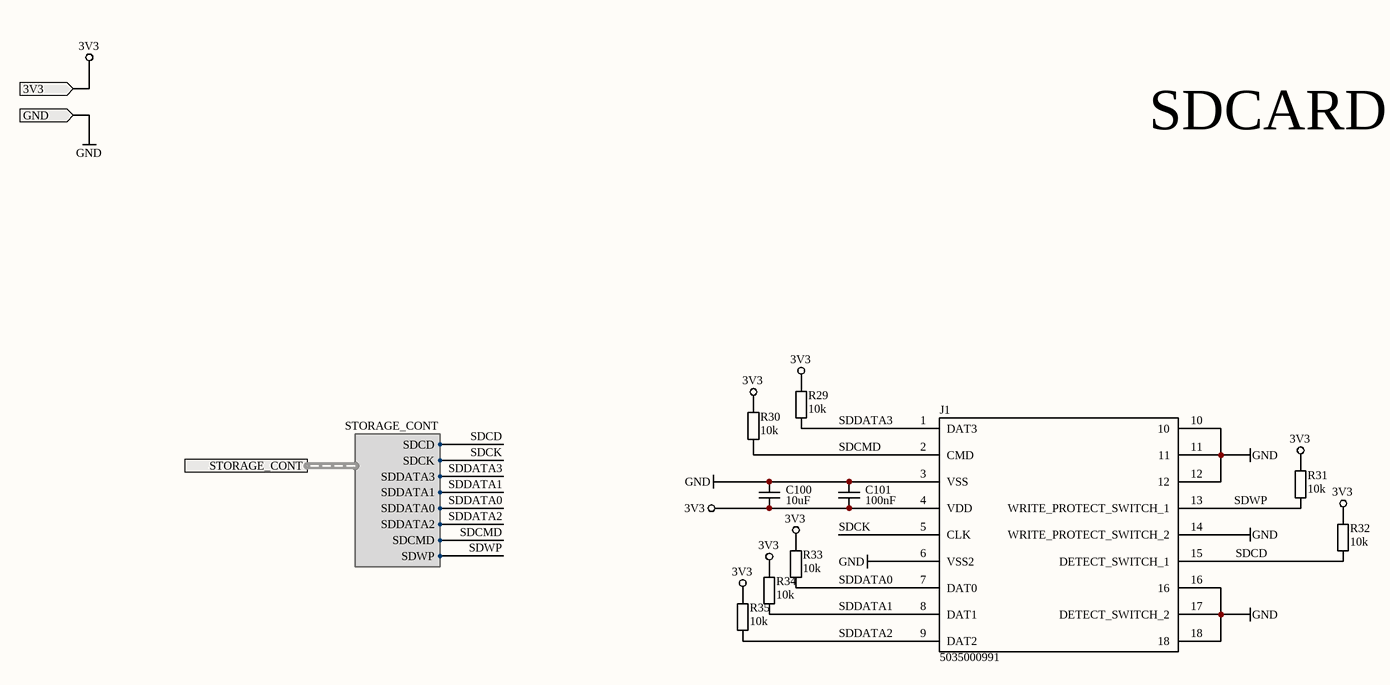
[diagram p8: Storage.SchDoc]

### Parts
C100  10uF  [C_0805]
C101  100nF  [C_0402]
J1  5035000991  [5035000991]
R29  10k  [R_0402]
R30  10k  [R_0402]
R31  10k  [R_0402]
R32  10k  [R_0402]
R33  10k  [R_0402]
R34  10k  [R_0402]
R35  10k  [R_0402]

### Ports
3V3 (in), GND (in), STORAGE_CONT (harness STORAGE_CONT)

### Harnesses
STORAGE_CONT: SDCK, SDCMD, SDDATA0, SDDATA1, SDDATA2, SDDATA3, SDCD, SDWP

### Nets
3V3: C100.2 C101.1 J1.4(VDD) R29.2 R30.2 R31.2 R32.2 R33.2 R34.2 R35.2 ; port 3V3
GND: C100.1 C101.2 J1.3(VSS) J1.6(VSS2) J1.10 J1.11 J1.12 J1.14(WRITE_PROTECT_SWITCH_2) J1.16 J1.17(DETECT_SWITCH_2) J1.18 ; port GND
SDCD: J1.15(DETECT_SWITCH_1) R32.1 ; port STORAGE_CONT.SDCD
SDCK: J1.5(CLK) ; port STORAGE_CONT.SDCK
SDCMD: J1.2(CMD) R30.1 ; port STORAGE_CONT.SDCMD
SDDATA0: J1.7(DAT0) R33.1 ; port STORAGE_CONT.SDDATA0
SDDATA1: J1.8(DAT1) R34.1 ; port STORAGE_CONT.SDDATA1
SDDATA2: J1.9(DAT2) R35.1 ; port STORAGE_CONT.SDDATA2
SDDATA3: J1.1(DAT3) R29.1 ; port STORAGE_CONT.SDDATA3
SDWP: J1.13(WRITE_PROTECT_SWITCH_1) R31.1 ; port STORAGE_CONT.SDWP

### Notes on the sheet
- SDCARD

### Library data of the parts
C100 = GCJ21BR71A106KE01L: 10uF 10V X7R
C101 = C0402C104J8RACAUTO: 100nF 10V 0402 X7R
J1 = 5035000991: SD Card Connector; Manufacturer_Name: Molex; Datasheet Link: https://www.arrow.com/en/products/5035000991/molex; Height: 2.95mm; Manufacturer_Part_Number: 5035000991; Arrow Part Number: 5035000991; Arrow Price/Stock: https://www.arrow.com/en/products/5035000991/molex?region=nac
R29-R35 = SFR01MZPF1002: 10k 1% 62.5mW

## Nets that join several sheets
3V3: Microcontroller (14 pins), Inputs (16 pins), Power (R16.2), TOPLEVEL/CAN1 (C?#9.2 IC?#1.5 JP?#4.1), TOPLEVEL/CAN2 (C?#11.2 IC?#2.5 JP?#6.1), TOPLEVEL/CAN3 (C?#13.2 IC?#3.5 JP?#8.1), TOPLEVEL/CAN4 (C?#15.2 IC?#4.5 JP?#10.1), Storage (10 pins)
5V: Power (5 pins), TOPLEVEL/CAN1 (C?#8.2 IC?#1.3), TOPLEVEL/CAN2 (C?#10.2 IC?#2.3), TOPLEVEL/CAN3 (C?#12.2 IC?#3.3), TOPLEVEL/CAN4 (C?#14.2 IC?#4.3)
GND: DashLogger (JP10.2), Microcontroller (13 pins), Inputs (35 pins), LEDs (10 pins), Power (22 pins), TOPLEVEL/CAN1 (5 pins), TOPLEVEL/CAN2 (5 pins), TOPLEVEL/CAN3 (5 pins), TOPLEVEL/CAN4 (5 pins), Storage (11 pins)
VBAT: DashLogger (JP10.36), Power (11 pins)
LED_10: Microcontroller (U?.12), LEDs (R85.1)
Net9R1_2: DashLogger (JP10.3), TOPLEVEL/CAN1 (9R1.2 IC?#1.7)
Net9R2_1: DashLogger (JP10.4), TOPLEVEL/CAN1 (9R2.1 IC?#1.6)
Net10R1_2: DashLogger (JP10.5), TOPLEVEL/CAN2 (10R1.2 IC?#2.7)
Net10R2_1: DashLogger (JP10.6), TOPLEVEL/CAN2 (10R2.1 IC?#2.6)
Net11R1_2: DashLogger (JP10.7), TOPLEVEL/CAN3 (11R1.2 IC?#3.7)
Net11R2_1: DashLogger (JP10.8), TOPLEVEL/CAN3 (11R2.1 IC?#3.6)
Net12R1_2: DashLogger (JP10.9), TOPLEVEL/CAN4 (12R1.2 IC?#4.7)
Net12R2_1: DashLogger (JP10.10), TOPLEVEL/CAN4 (12R2.1 IC?#4.6)
NetC102_2: DashLogger (JP10.12), Microcontroller (U?.40), Inputs (C102.2 D7.3 R61.2)
NetC103_2: DashLogger (JP10.13), Microcontroller (U?.39), Inputs (C103.2 D9.3 R65.2)
NetC104_2: DashLogger (JP10.14), Microcontroller (U?.29), Inputs (C104.2 D12.3 R68.2)
NetC105_2: DashLogger (JP10.15), Microcontroller (U?.28), Inputs (C105.2 D14.3 R72.2)
NetC106_2: DashLogger (JP10.16), Microcontroller (U?.27), Inputs (C106.2 D16.3 R76.2)
NetC107_2: DashLogger (JP10.17), Microcontroller (U?.24), Inputs (C107.2 D18.3 R78.2)
NetC109_2: DashLogger (JP10.1), Power (C109.2 D2.2 D3.2)
NetD4_3: DashLogger (JP10.11), Inputs (D4.3 R57.2)
NetD5_3: Microcontroller (U?.4), Inputs (D5.3 R56.1 R58.2)
NetD6_3: Microcontroller (U?.6), Inputs (D6.3 R59.1 R60.2)
NetD8_3: Microcontroller (U?.8), Inputs (D8.3 R62.1 R63.2)
NetD10_3: Microcontroller (U?.11), Inputs (D10.3 R64.1 R66.2)
NetD11_3: Microcontroller (U?.13), Inputs (D11.3 R67.1 R69.2)
NetD13_3: Microcontroller (U?.14), Inputs (D13.3 R70.1 R71.2)
NetD15_3: Microcontroller (U?.15), Inputs (D15.3 R73.1 R74.2)
NetD17_3: Microcontroller (U?.16), Inputs (D17.3 R75.1 R77.2)
NetIC?#1_1: Microcontroller (U?.3), TOPLEVEL/CAN1 (IC?#1.1)
NetIC?#1_4: Microcontroller (U?.1), TOPLEVEL/CAN1 (IC?#1.4)
NetIC?#2_1: Microcontroller (U?.60), TOPLEVEL/CAN2 (IC?#2.1)
NetIC?#2_4: Microcontroller (U?.61), TOPLEVEL/CAN2 (IC?#2.4)
NetIC?#3_1: Microcontroller (U?.58), TOPLEVEL/CAN3 (IC?#3.1)
NetIC?#3_4: Microcontroller (U?.59), TOPLEVEL/CAN3 (IC?#3.4)
NetIC?#4_1: Microcontroller (U?.5), TOPLEVEL/CAN4 (IC?#4.1)
NetIC?#4_4: Microcontroller (U?.2), TOPLEVEL/CAN4 (IC?#4.4)
NetJP10_18: DashLogger (JP10.18), Inputs (R56.2)
NetJP10_19: DashLogger (JP10.19), Inputs (R59.2)
NetJP10_20: DashLogger (JP10.20), Inputs (R62.2)
NetJP10_21: DashLogger (JP10.21), Inputs (R64.2)
NetJP10_22: DashLogger (JP10.22), Inputs (R67.2)
NetJP10_23: DashLogger (JP10.23), Inputs (R70.2)
NetJP10_24: DashLogger (JP10.24), Inputs (R73.2)
NetJP10_25: DashLogger (JP10.25), Inputs (R75.2)
NetJP10_26: DashLogger (JP10.26), LEDs (R84.2)
NetJP10_27: DashLogger (JP10.27), LEDs (R81.2)
NetJP10_28: DashLogger (JP10.28), LEDs (R55.2)
NetJP10_29: DashLogger (JP10.29), LEDs (R52.2)
NetJP10_30: DashLogger (JP10.30), LEDs (R49.2)
NetJP10_31: DashLogger (JP10.31), LEDs (R46.2)
NetJP10_32: DashLogger (JP10.32), LEDs (R43.2)
NetJP10_33: DashLogger (JP10.33), LEDs (R40.2)
NetJP10_34: DashLogger (JP10.34), LEDs (R37.2)
NetJP10_35: DashLogger (JP10.35), LEDs (R23.2)
NetJP?#1_17: Display (JP?#1.17 JP?#1.18), Power (JP?#2.2)
NetJP?#1_19: Display (JP?#1.19 JP?#1.20), Power (JP?#3.2)
NetR25_1: Microcontroller (U?.63), LEDs (R25.1)
NetR38_1: Microcontroller (U?.62), LEDs (R38.1)
NetR41_1: Microcontroller (U?.55), LEDs (R41.1)
NetR44_1: Microcontroller (U?.54), LEDs (R44.1)
NetR47_1: Microcontroller (U?.53), LEDs (R47.1)
NetR50_1: Microcontroller (U?.52), LEDs (R50.1)
NetR53_1: Microcontroller (U?.51), LEDs (R53.1)
NetR79_1: Microcontroller (U?.50), LEDs (R79.1)
NetR82_1: Microcontroller (U?.49), LEDs (R82.1)